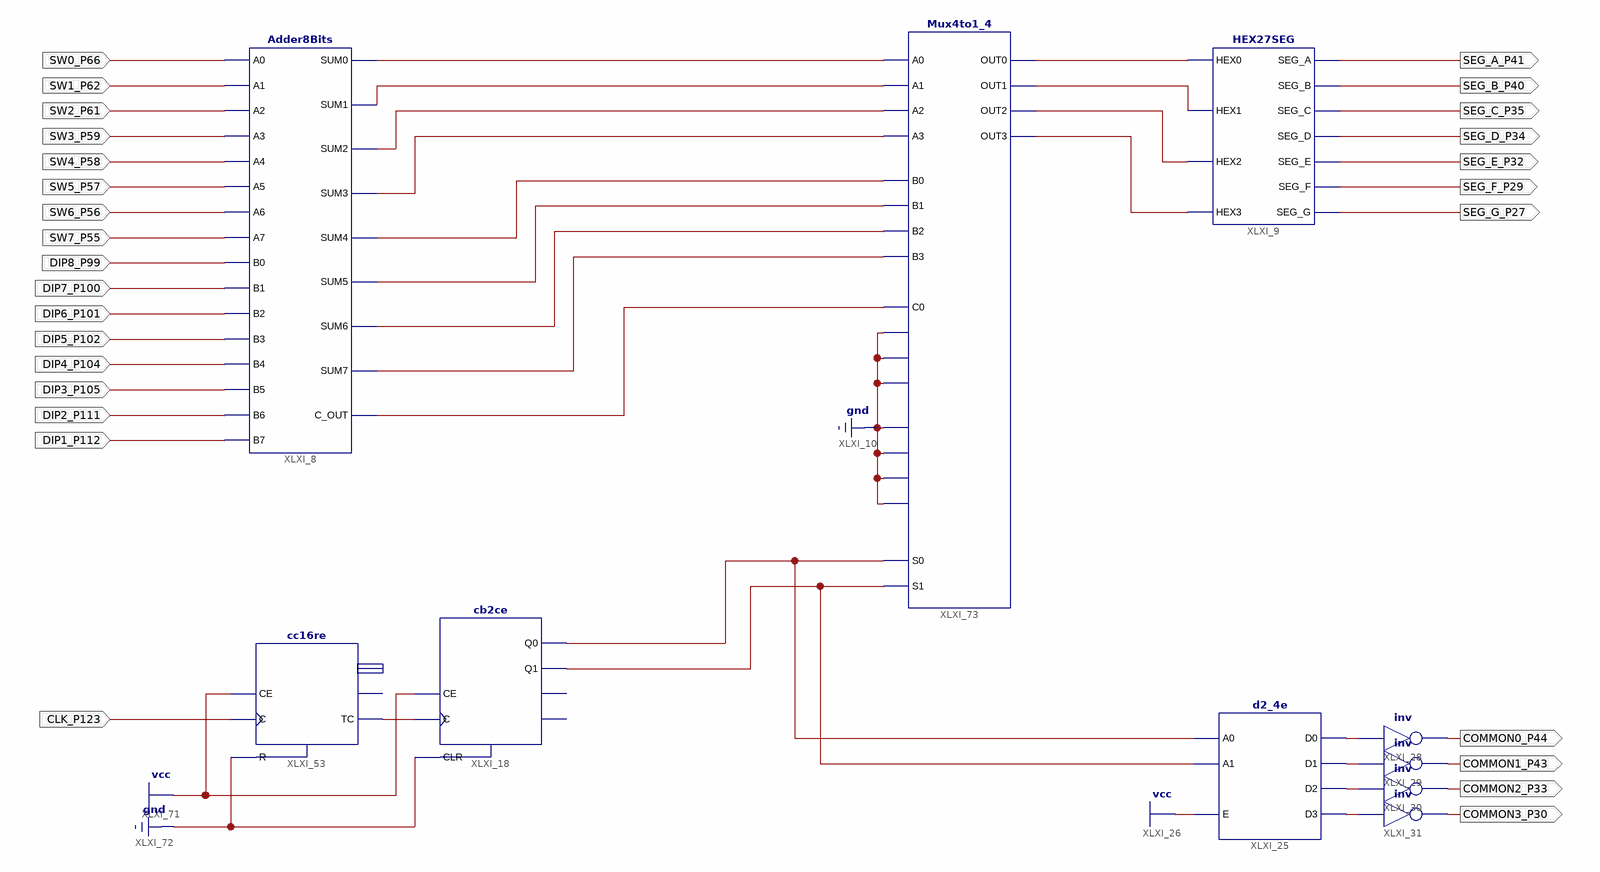
[diagram p0: schematic sheet 1]
// Xilinx ISE schematic MainCircuit.sch (spartan6) as structural Verilog: 10 symbols, 28 ports
module MainCircuit (
  input  SW0_P66,
  input  SW1_P62,
  input  SW2_P61,
  input  SW3_P59,
  input  SW4_P58,
  input  SW5_P57,
  input  SW6_P56,
  input  SW7_P55,
  input  DIP8_P99,
  input  DIP7_P100,
  input  DIP6_P101,
  input  DIP5_P102,
  input  DIP4_P104,
  input  DIP3_P105,
  input  DIP2_P111,
  input  DIP1_P112,
  input  CLK_P123,
  output SEG_A_P41,
  output SEG_B_P40,
  output SEG_C_P35,
  output SEG_D_P34,
  output SEG_E_P32,
  output SEG_F_P29,
  output SEG_G_P27,
  output COMMON3_P30,
  output COMMON2_P33,
  output COMMON1_P43,
  output COMMON0_P44
);

  wire XLXN_5, XLXN_6, XLXN_7, XLXN_8, XLXN_32, XLXN_33, XLXN_34, XLXN_35, XLXN_36, XLXN_37, XLXN_38,
       XLXN_39, XLXN_98, XLXN_99, XLXN_100, XLXN_101, XLXN_151, XLXN_156, XLXN_157, XLXN_213;

  HEX27SEG XLXI_9 (
    .HEX0(XLXN_5), .HEX1(XLXN_6), .HEX2(XLXN_7), .HEX3(XLXN_8), .SEG_A(SEG_A_P41), .SEG_B(SEG_B_P40),
    .SEG_C(SEG_C_P35), .SEG_D(SEG_D_P34), .SEG_E(SEG_E_P32), .SEG_F(SEG_F_P29), .SEG_G(SEG_G_P27));
  Adder8Bits XLXI_8 (
    .A0(SW0_P66), .SUM0(XLXN_32), .SUM1(XLXN_33), .SUM2(XLXN_34), .SUM3(XLXN_35), .SUM4(XLXN_36),
    .SUM5(XLXN_37), .SUM6(XLXN_38), .SUM7(XLXN_39), .C_OUT(XLXN_213), .A1(SW1_P62), .A2(SW2_P61),
    .A3(SW3_P59), .A4(SW4_P58), .A5(SW5_P57), .A6(SW6_P56), .A7(SW7_P55), .B0(DIP8_P99), .B1(DIP7_P100),
    .B2(DIP6_P101), .B3(DIP5_P102), .B4(DIP4_P104), .B5(DIP3_P105), .B6(DIP2_P111), .B7(DIP1_P112));
  d2_4e XLXI_25 (.A0(XLXN_156), .A1(XLXN_157), .E(1'b1), .D0(XLXN_98), .D1(XLXN_99), .D2(XLXN_100), .D3(XLXN_101));
  not XLXI_31 (COMMON3_P30, XLXN_101);
  not XLXI_30 (COMMON2_P33, XLXN_100);
  not XLXI_29 (COMMON1_P43, XLXN_99);
  not XLXI_28 (COMMON0_P44, XLXN_98);
  cb2ce XLXI_18 (.C(XLXN_151), .CE(1'b1), .CLR(1'b0), .Q0(XLXN_156), .Q1(XLXN_157));  // open: CEO, TC
  cc16re XLXI_53 (.C(CLK_P123), .CE(1'b1), .R(1'b0), .TC(XLXN_151));  // open: CEO, Q
  Mux4to1_4 XLXI_73 (
    .OUT0(XLXN_5), .OUT1(XLXN_6), .OUT2(XLXN_7), .OUT3(XLXN_8), .A0(XLXN_32), .A1(XLXN_33), .A2(XLXN_34),
    .A3(XLXN_35), .S1(XLXN_157), .S0(XLXN_156), .B0(XLXN_36), .C0(XLXN_213), .B1(XLXN_37), .C1(1'b0),
    .B2(XLXN_38), .C2(1'b0), .B3(XLXN_39), .D0(1'b0), .D1(1'b0), .D2(1'b0), .D3(1'b0), .C3(1'b0));
endmodule
